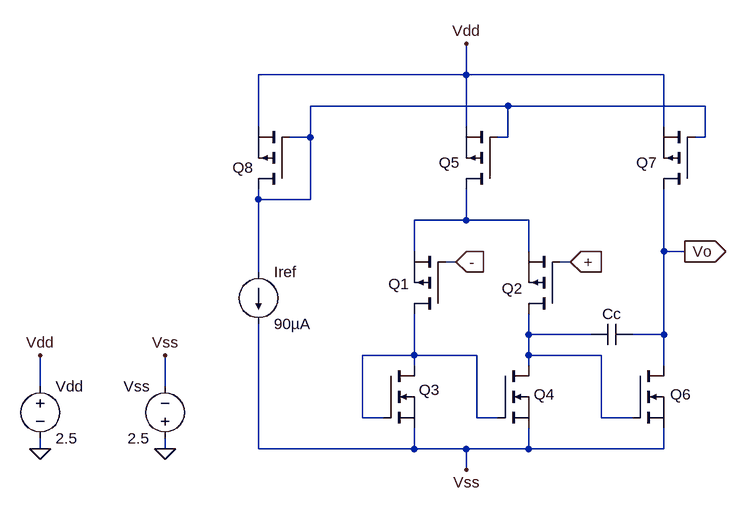
[diagram p0: schematic circuito1.asc]
circuito1.asc, the LTspice schematic file:
Version 4
SHEET 1 880 824
WIRE 336 128 336 80
WIRE 336 128 16 128
WIRE 640 128 336 128
WIRE 400 176 96 176
WIRE 704 176 400 176
WIRE 16 208 16 128
WIRE 336 208 336 128
WIRE 640 208 640 128
WIRE 96 224 96 176
WIRE 96 224 64 224
WIRE 400 224 400 176
WIRE 400 224 384 224
WIRE 704 224 704 176
WIRE 704 224 688 224
WIRE 16 320 16 304
WIRE 96 320 96 224
WIRE 96 320 16 320
WIRE 336 352 336 304
WIRE 336 352 256 352
WIRE 432 352 336 352
WIRE 256 400 256 352
WIRE 432 400 432 352
WIRE 640 400 640 304
WIRE 672 400 640 400
WIRE 320 416 304 416
WIRE 496 416 480 416
WIRE 16 432 16 320
WIRE 432 528 432 496
WIRE 528 528 432 528
WIRE 640 528 640 400
WIRE 640 528 592 528
WIRE 256 560 256 496
WIRE 256 560 176 560
WIRE 352 560 256 560
WIRE 432 560 432 528
WIRE 544 560 432 560
WIRE 256 576 256 560
WIRE 432 576 432 560
WIRE 640 576 640 528
WIRE -320 608 -320 560
WIRE -128 608 -128 560
WIRE 176 656 176 560
WIRE 208 656 176 656
WIRE 352 656 352 560
WIRE 384 656 352 656
WIRE 544 656 544 560
WIRE 592 656 544 656
WIRE -320 704 -320 688
WIRE -128 704 -128 688
WIRE 16 704 16 512
WIRE 256 704 256 672
WIRE 256 704 16 704
WIRE 336 704 256 704
WIRE 432 704 432 672
WIRE 432 704 336 704
WIRE 640 704 640 672
WIRE 640 704 432 704
WIRE 336 736 336 704
FLAG -320 704 0
FLAG 336 80 Vdd
FLAG -320 560 Vdd
FLAG -128 704 0
FLAG -128 560 Vss
FLAG 336 736 Vss
FLAG 672 400 Vo
IOPIN 672 400 Out
FLAG 496 416 +
IOPIN 496 416 In
FLAG 320 416 -
IOPIN 320 416 In
SYMBOL voltage -320 592 R0
SYMATTR InstName Vdd
SYMATTR Value 2.5
SYMBOL pmos 384 304 R180
WINDOW 0 58 41 Left 2
SYMATTR InstName Q5
SYMATTR Value ""
SYMBOL pmos 688 304 R180
WINDOW 0 58 41 Left 2
SYMATTR InstName Q7
SYMATTR Value ""
SYMBOL pmos 304 496 R180
WINDOW 0 56 46 Left 2
SYMATTR InstName Q1
SYMATTR Value ""
SYMBOL current 16 432 R0
SYMATTR InstName Iref
SYMATTR Value 90µA
SYMBOL nmos 384 576 R0
WINDOW 0 56 44 Left 2
SYMATTR InstName Q4
SYMATTR Value ""
SYMBOL voltage -128 704 R180
WINDOW 0 24 96 Left 2
WINDOW 3 24 16 Left 2
SYMATTR InstName Vss
SYMATTR Value 2.5
SYMBOL cap 592 512 R90
WINDOW 0 0 32 VBottom 2
WINDOW 3 32 32 VTop 2
SYMATTR InstName Cc
SYMATTR Value ""
SYMBOL nmos 592 576 R0
WINDOW 0 58 44 Left 2
SYMATTR InstName Q6
SYMATTR Value ""
SYMBOL pmos 64 304 R180
WINDOW 0 56 33 Left 2
SYMATTR InstName Q8
SYMATTR Value ""
SYMBOL pmos 480 496 R180
WINDOW 0 57 39 Left 2
SYMATTR InstName Q2
SYMATTR Value ""
SYMBOL nmos 208 576 R0
WINDOW 0 55 37 Left 2
SYMATTR InstName Q3
SYMATTR Value ""

The netlist it stands for:
* circuito1.asc
Vdd Vdd 0 2.5
M§Q5 N002 N001 Vdd Vdd
M§Q7 Vo N001 Vdd Vdd
M§Q1 N004 - N002 N002
Iref N001 Vss 90µA
M§Q4 N003 N004 Vss Vss
Vss 0 Vss 2.5
Cc Vo N003
M§Q6 Vo N003 Vss Vss
M§Q8 N001 N001 Vdd Vdd
M§Q2 N003 + N002 N002
M§Q3 N004 N004 Vss Vss
.model NMOS NMOS
.model PMOS PMOS
.lib standard.mos
.backanno
.end